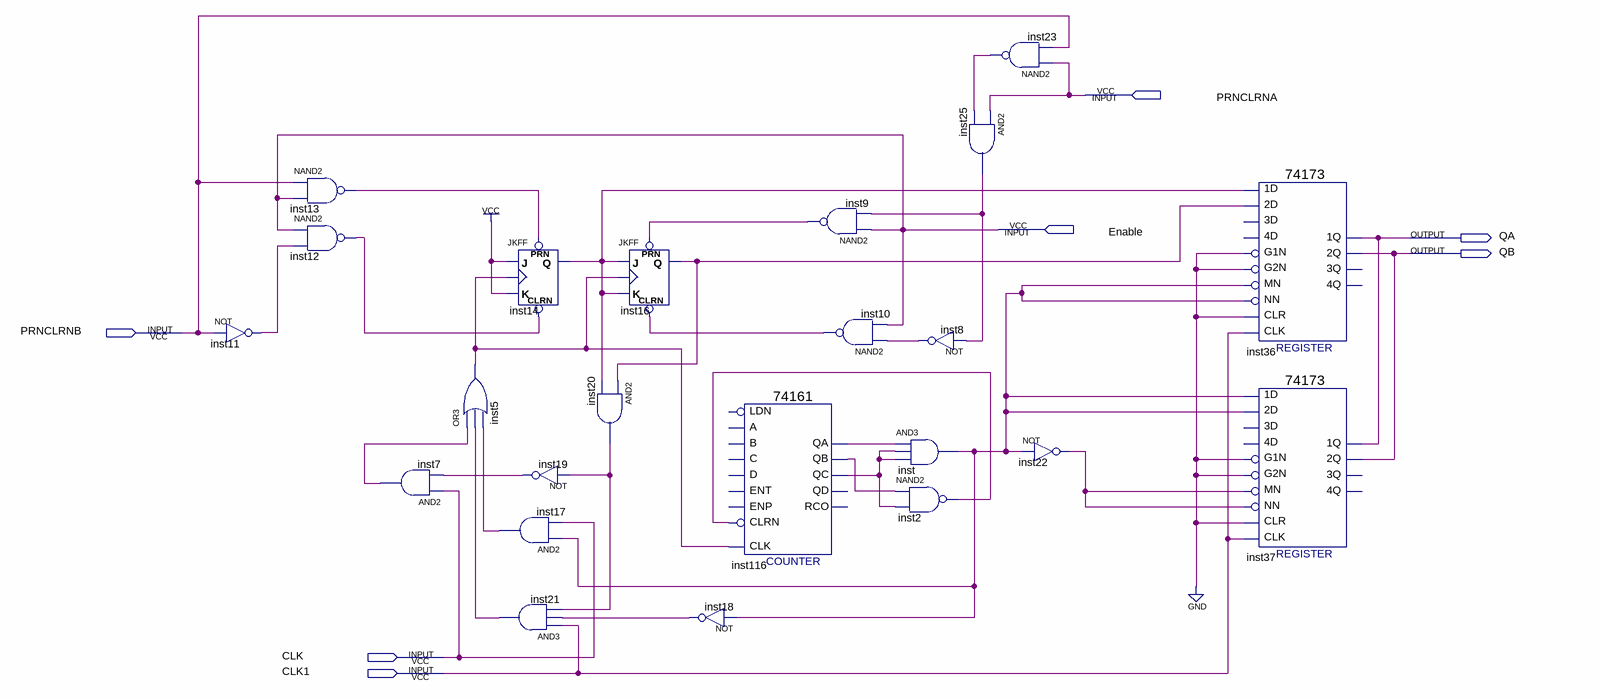
[diagram p0: schematic sheet]
// Quartus schematic Control.bdf as structural Verilog: 23 symbols, 7 pins
module Control (
  input  PRNCLRNA,
  input  Enable,
  input  PRNCLRNB,
  input  CLK,
  input  CLK1,
  output QA,
  output QB
);

  wire inst2_out, inst5_out, inst7_out, inst8_out, inst9_out, inst10_out, inst11_out, inst12_out, inst13_out,
       inst14_q, inst16_q, inst17_out, inst18_out, inst19_out, inst20_out, inst21_out, inst22_out,
       inst23_out, inst25_out, inst116_qa, inst116_qb, inst116_qc, inst_out;

  not inst11 (inst11_out, PRNCLRNB);
  nand inst13 (inst13_out, PRNCLRNB, Enable);
  nand inst12 (inst12_out, Enable, inst11_out);
  and inst7 (inst7_out, CLK, inst19_out);
  or inst5 (inst5_out, inst7_out, inst21_out, inst17_out);
  and inst17 (inst17_out, inst_out, CLK);
  and inst21 (inst21_out, CLK1, inst18_out, inst20_out);
  JKFF inst14 (.PRN(inst13_out), .CLRN(inst12_out), .K(1'b1), .J(1'b1), .CLK(inst5_out), .Q(inst14_q));
  not inst19 (inst19_out, inst20_out);
  JKFF inst16 (.PRN(inst9_out), .CLRN(inst10_out), .K(inst14_q), .J(inst14_q), .CLK(inst5_out), .Q(inst16_q));
  and inst20 (inst20_out, inst16_q, inst14_q);
  not inst18 (inst18_out, inst_out);
  \74161  inst116 (
    .CLRN(inst2_out), .CLK(inst5_out), .QC(inst116_qc), .QB(inst116_qb), .QA(inst116_qa));  // open: ENP, LDN, A, D, ENT, B, C, QD, RCO
  nand inst9 (inst9_out, Enable, inst25_out);
  nand inst10 (inst10_out, inst8_out, Enable);
  not inst8 (inst8_out, inst25_out);
  and inst (inst_out, inst116_qa, inst116_qc, inst116_qc);
  nand inst2 (inst2_out, inst116_qb, inst116_qc);
  nand inst23 (inst23_out, PRNCLRNA, PRNCLRNB);
  and inst25 (inst25_out, PRNCLRNA, inst23_out);
  not inst22 (inst22_out, inst_out);
  \74173  inst36 (
    .MN(inst_out), .\1D (inst14_q), .\2D (inst16_q), .G1N(1'b0), .G2N(1'b0), .NN(inst_out), .CLR(1'b0),
    .CLK(CLK1), .\2Q (QB), .\1Q (QA));  // open: 3D, 4D, 3Q, 4Q
  \74173  inst37 (
    .MN(inst22_out), .\1D (inst_out), .\2D (inst_out), .G1N(1'b0), .G2N(1'b0), .NN(inst22_out), .CLR(1'b0),
    .CLK(CLK1), .\2Q (QB), .\1Q (QA));  // open: 3D, 4D, 3Q, 4Q
endmodule
